# Altium project SlideRailCtrl.PrjPcb
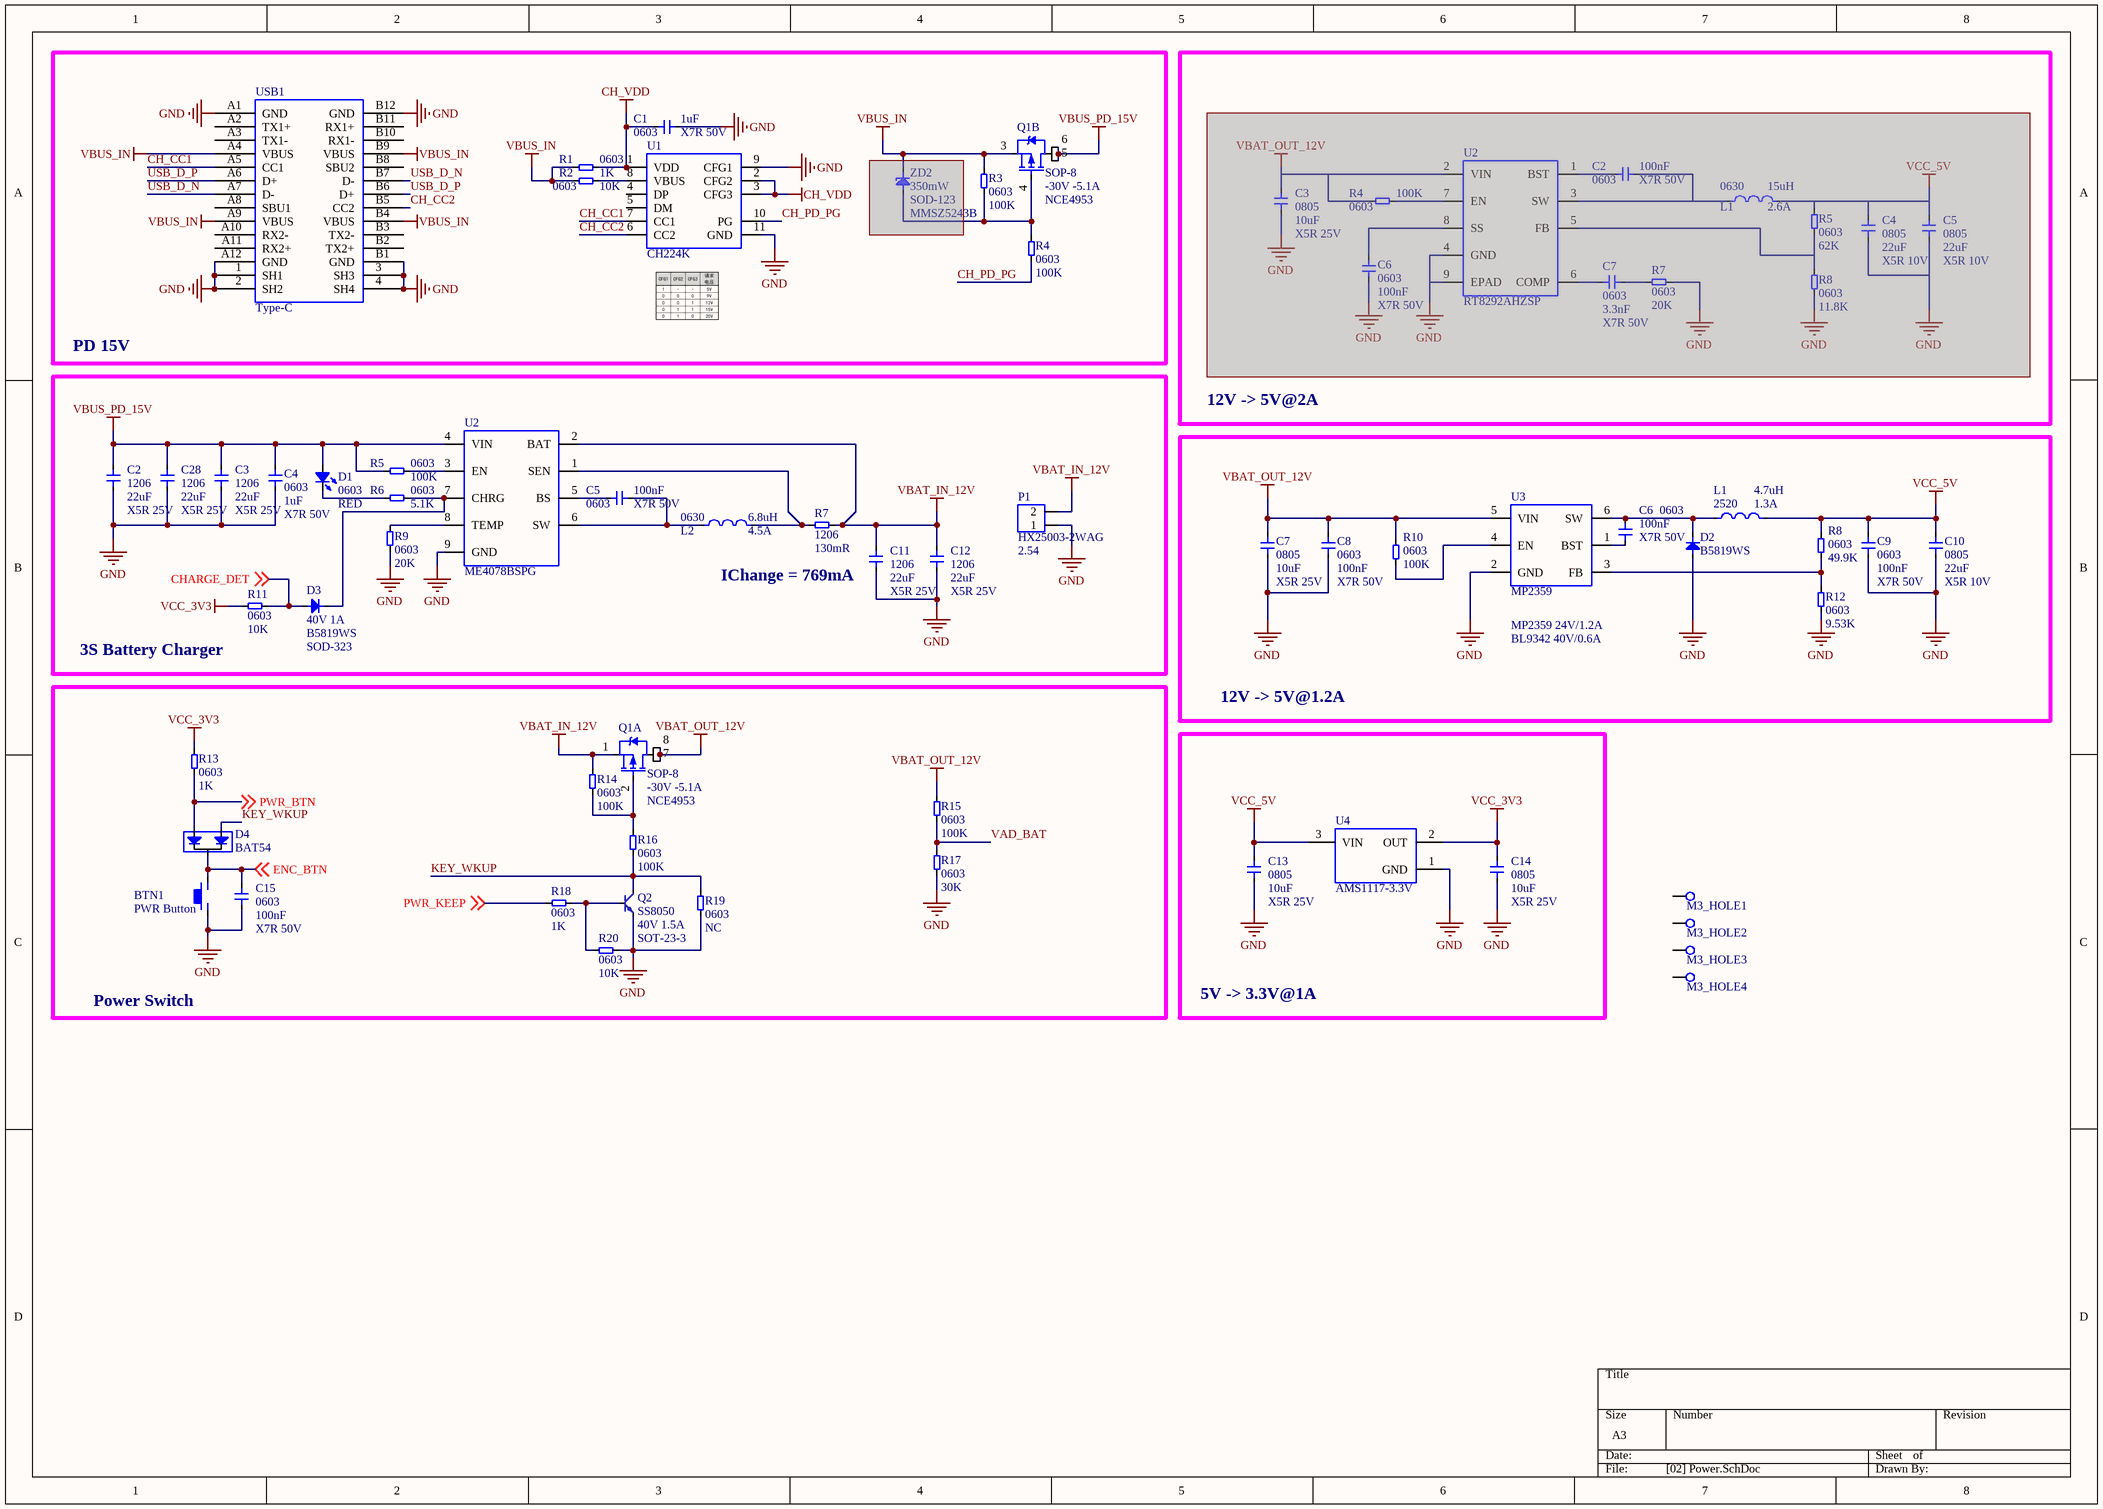
[diagram p0: [02] Power.SchDoc]
2 sheets, 115 parts. Net scope: global (net labels, ports and power ports of the same name join across sheets).
Board file: SlideRailCtrl.PcbDoc
Sheets:
  [02] Power.SchDoc
  [03] MainBoard.SchDoc

## Sheet [02] Power.SchDoc
size A3

### Parts
(Parts that share a designator on the sheet are numbered #1, #2 ... from top to bottom, then left to right.)
BTN1  PWR Button  [BTN-4P-4.2*3.4*2.5]
C1  Footprint: 0603  Specification: X7R 50V  [CAP_0603]  (hidden comment: 1uF)
C2#1  Footprint: 0603  Specification: X7R 50V  [CAP_0603]  (hidden comment: 100nF)  (masked out: inside a compile mask, not in the netlist)
C2#2  Footprint: 1206  Specification: X5R 25V  [CAP_1206]  (hidden comment: 22uF)
C3#1  Footprint: 0805  Specification: X5R 25V  [CAP_0805]  (hidden comment: 10uF)  (masked out: inside a compile mask, not in the netlist)
C3#2  Footprint: 1206  Specification: X5R 25V  [CAP_1206]  (hidden comment: 22uF)
C4#1  Footprint: 0805  Specification: X5R 10V  [CAP_0805]  (hidden comment: 22uF)  (masked out: inside a compile mask, not in the netlist)
C4#2  Footprint: 0603  Specification: X7R 50V  [CAP_0603]  (hidden comment: 1uF)
C5#1  Footprint: 0805  Specification: X5R 10V  [CAP_0805]  (hidden comment: 22uF)  (masked out: inside a compile mask, not in the netlist)
C5#2  Footprint: 0603  Specification: X7R 50V  [CAP_0603]  (hidden comment: 100nF)
C6#1  Footprint: 0603  Specification: X7R 50V  [CAP_0603]  (hidden comment: 100nF)  (masked out: inside a compile mask, not in the netlist)
C6#2  Footprint: 0603  Specification: X7R 50V  [CAP_0603]  (hidden comment: 100nF)
C7#1  Footprint: 0603  Specification: X7R 50V  [CAP_0603]  (hidden comment: 3.3nF)  (masked out: inside a compile mask, not in the netlist)
C7#2  Footprint: 0805  Specification: X5R 25V  [CAP_0805]  (hidden comment: 10uF)
C8  Footprint: 0603  Specification: X7R 50V  [CAP_0603]  (hidden comment: 100nF)
C9  Footprint: 0603  Specification: X7R 50V  [CAP_0603]  (hidden comment: 100nF)
C10  Footprint: 0805  Specification: X5R 10V  [CAP_0805]  (hidden comment: 22uF)
C11  Footprint: 1206  Specification: X5R 25V  [CAP_1206]  (hidden comment: 22uF)
C12  Footprint: 1206  Specification: X5R 25V  [CAP_1206]  (hidden comment: 22uF)
C13  Footprint: 0805  Specification: X5R 25V  [CAP_0805]  (hidden comment: 10uF)
C14  Footprint: 0805  Specification: X5R 25V  [CAP_0805]  (hidden comment: 10uF)
C15  Footprint: 0603  Specification: X7R 50V  [CAP_0603]  (hidden comment: 100nF)
C28  Footprint: 1206  Specification: X5R 25V  [CAP_1206]  (hidden comment: 22uF)
D1  Footprint: 0603  [LED_0603]  (hidden comment: RED)
D2  B5819WS  [SOD-323]
D3  Specification: 40V 1A  [SOD-323]  (hidden comment: B5819WS)
D4#1  BAT54  [SOT-23-3]
L1#1  Specification: 2.6A  Footprint: 0630  [IND_P_0630]  (hidden comment: 15uH)  (masked out: inside a compile mask, not in the netlist)
L1#2  Specification: 1.3A  Footprint: 2520  [IND_1008]  (hidden comment: 4.7uH)
L2  Specification: 4.5A  Footprint: 0630  [IND_P_0630]  (hidden comment: 6.8uH)
M3_HOLE1  TestPoint  [Hole_M3_PAD]  (value not drawn)
M3_HOLE2  TestPoint  [Hole_M3_PAD]  (value not drawn)
M3_HOLE3  TestPoint  [Hole_M3_PAD]  (value not drawn)
M3_HOLE4  TestPoint  [Hole_M3_PAD]  (value not drawn)
P1  Type: 2.54  [XH_2-SLEEP]  (hidden comment: HX25003-2WAG)
Q1  Footprint: SOP-8  Specification: -30V -5.1A  [SOP-8-P1.27]  (hidden comment: NCE4953)  (parts A,B of 2)
Q2  Specification: 40V 1.5A  [SOT-23-3]  (hidden comment: SS8050)
R1  Footprint: 0603  [RES_0603]  (hidden comment: 1K)
R2  Footprint: 0603  [RES_0603]  (hidden comment: 10K)
R3  Footprint: 0603  [RES_0603]  (hidden comment: 100K)
R4#1  Footprint: 0603  [RES_0603]  (hidden comment: 100K)  (masked out: inside a compile mask, not in the netlist)
R4#2  Footprint: 0603  [RES_0603]  (hidden comment: 100K)
R5#1  Footprint: 0603  [RES_0603]  (hidden comment: 62K)  (masked out: inside a compile mask, not in the netlist)
R5#2  Footprint: 0603  [RES_0603]  (hidden comment: 100K)
R6  Footprint: 0603  [RES_0603]  (hidden comment: 5.1K)
R7#1  Footprint: 0603  [RES_0603]  (hidden comment: 20K)  (masked out: inside a compile mask, not in the netlist)
R7#2  Footprint: 1206  [RES_1206]  (hidden comment: 130mR)
R8#1  Footprint: 0603  [RES_0603]  (hidden comment: 11.8K)  (masked out: inside a compile mask, not in the netlist)
R8#2  Footprint: 0603  [RES_0603]  (hidden comment: 49.9K)
R9  Footprint: 0603  [RES_0603]  (hidden comment: 20K)
R10  Footprint: 0603  [RES_0603]  (hidden comment: 100K)
R11#1  Footprint: 0603  [RES_0603]  (hidden comment: 10K)
R12#1  Footprint: 0603  [RES_0603]  (hidden comment: 9.53K)
R13  Footprint: 0603  [RES_0603]  (hidden comment: 1K)
R14  Footprint: 0603  [RES_0603]  (hidden comment: 100K)
R15  Footprint: 0603  [RES_0603]  (hidden comment: 100K)
R16#1  Footprint: 0603  [RES_0603]  (hidden comment: 100K)
R17  Footprint: 0603  [RES_0603]  (hidden comment: 30K)
R18  Footprint: 0603  [RES_0603]  (hidden comment: 1K)
R19  Footprint: 0603  [RES_0603]  (hidden comment: NC)
R20  Footprint: 0603  [RES_0603]  (hidden comment: 10K)
U1  CH224K  [HSOP-10-P1.0]
U2#1  RT8292AHZSP  [HSOP-8-P1.27]  (masked out: inside a compile mask, not in the netlist)
U2#2  ME4078BSPG  [HSOP-8-P1.27]
U3  MP2359  [SOT-23-6]
U4  AMS1117-3.3V  [SOT-223-3]
USB1  Type-C  [USB-Type-C]
ZD2  Specification: 350mW  [SOD-123]  (hidden comment: MMSZ5243B)  (masked out: inside a compile mask, not in the netlist)

### Blocks framed on the sheet
PD 15V: C1 Q1 R1-R3 R4#2 U1 USB1 ZD2
12V -> 5V@2A: C2#1 C3#1 C4#1 C5#1 C6#1 C7#1 L1#1 R4#1 R5#1 R7#1 R8#1 U2#1
12V -> 5V@1.2A: C6#2 C7#2 C8-C10 D2 L1#2 R8#2 R10 R12#1 U3
Power Switch: BTN1 C15 D4#1 Q1 Q2 R13-R15 R16#1 R17-R20
5V -> 3.3V@1A: C13 C14 U4

### Nets
CH_VDD: C1.1 R1.1 U1.1(VDD) U1.2(CFG2) U1.3(CFG3)
GND: BTN1.1 C1.2 C2#2.1 C3#2.1 C4#2.2 C7#2.2 C8.2 C9.2 C10.2 C11.1 C12.1 C13.1 C14.1 C15.2 C28.1 D2.1 P1.1 Q2.2(E) R9.2 R12#1.2 R17.1 R19.2 R20.1 U1.9(CFG1) U1.11(GND) U2#2.9(GND) U3.2(GND) U4.1(GND) USB1.1(SH1) USB1.2(SH2) USB1.3(SH3) USB1.4(SH4) USB1.A1(GND) USB1.A12(GND) USB1.B1(GND) USB1.B12(GND)
VBAT_IN_12V: C11.2 C12.2 P1.2 Q1.1(S) R7#2.1 R14.2 U2#2.2(BAT)
VBAT_OUT_12V: C7#2.1 C8.1 Q1.7(D) Q1.8(D) R10.1 R15.2 U3.5(VIN)
VBUS_IN: Q1.3(S) R1.2 R2.2 R3.2 USB1.A4(VBUS) USB1.A9(VBUS) USB1.B4(VBUS) USB1.B9(VBUS)
VBUS_PD_15V: C2#2.2 C3#2.2 C4#2.1 C28.2 D1.1(A) Q1.5(D) Q1.6(D) R5#2.2 U2#2.4(VIN)
VCC_3V3: C14.2 R11#1.1 R13.2 U4.2(OUT)
VCC_5V: C9.1 C10.1 C13.2 L1#2.2 R8#2.1 U4.3(VIN)
CH_CC1: U1.7(CC1) USB1.A5(CC1)
CH_CC2: U1.6(CC2) USB1.B5(CC2)
CH_PD_PG: R4#2.1 U1.10(PG)
CHARGE_DET: D3.1 R11#1.2 ; off-sheet CHARGE_DET
ENC_BTN: BTN1.2 C15.1 D4#1.3 ; off-sheet ENC_BTN
KEY_WKUP: D4#1.2 Q2.3(C) R16#1.1 R19.1
PWR_BTN: D4#1.1 R13.1 ; off-sheet PWR_BTN
PWR_KEEP: R18.1 ; off-sheet PWR_KEEP
USB_D_N: USB1.A7(D-) USB1.B7(D-)
USB_D_P: USB1.A6(D+) USB1.B6(D+)
VAD_BAT: R15.1 R17.2
NetC5#2_1: C5#2.1 L2.1 U2#2.6(SW)
NetC5#2_2: C5#2.2 U2#2.5(BS)
NetC6#2_1: C6#2.1 D2.2 L1#2.1 U3.6(SW)
NetC6#2_2: C6#2.2 U3.1(BST)
NetD1_2: D1.2(K) R6.2
NetD3_2: D3.2 R6.1 U2#2.7(CHRG)
NetL2_2: L2.2 R7#2.2 U2#2.1(SEN)
NetQ1_2: Q1.2(G) R14.1 R16#1.2
NetQ1_4: Q1.4(G) R3.1 R4#2.2
NetQ2_1: Q2.1(B) R18.2 R20.2
NetR2_1: R2.1 U1.8(VBUS)
NetR5#2_1: R5#2.1 U2#2.3(EN)
NetR8#2_2: R8#2.2 R12#1.1 U3.3(FB)
NetR9_1: R9.1 U2#2.8(TEMP)
NetR10_2: R10.2 U3.4(EN)

Not connected (* = marked no-connect by the designer): M3_HOLE1 1; M3_HOLE2 1; M3_HOLE3 1; M3_HOLE4 1; U1 4(DP) 5(DM); USB1 A2(TX1+) A3(TX1-) A8(SBU1) A10(RX2-) A11(RX2+) B2(TX2+) B3(TX2-) B8(SBU2) B10(RX1-) B11(RX1+)

### Notes on the sheet
- IChange = 769mA
- (near U3) MP2359 24V/1.2A
- BL9342 40V/0.6A
- (near R11#1) 3S Battery Charger
- Title
- Size:
- Date:
- A4
- Number:
- Time:
- Revision:
- Sheet
- of
- File:

### Library data of the parts
BTN1 = Button
C1 C2#1 C2#2 C3#1 C3#2 C4#1 C4#2 C5#1 C5#2 C6#1 C6#2 C7#1 C7#2 C8-C15 C28 = CAP: Capacitor; Manufacturer: *
  C1 C4#2: Value: 1uF
  C2#1 C5#2 C6#1 C6#2 C8 C9 C15: Value: 100nF
  C2#2 C3#2 C4#1 C5#1 C10-C12 C28: Value: 22uF
  C3#1 C7#2 C13 C14: Value: 10uF
  C7#1: Value: 3.3nF
D1 = LED: Value: RED
D2 = Diode: Specification: 40V 1A; Manufacturer: *; Value: B5819WS
D3 = Diode: Manufacturer: *; Value: B5819WS
D4#1 = Diode-2: Value: BAT54
L1#1 L1#2 L2 = IND: Inductor; Manufacturer: *
  L1#1: Value: 15uH
  L1#2: Value: 4.7uH
  L2: Value: 6.8uH
P1 = HDR1x2: Header; Value: HX25003-2WAG
Q1 = Dual_MOS-P: Dual P-Channel MOSFET; Value: NCE4953
Q2 = BJT_NPN: Transistor; Value: SS8050
R1-R3 R4#1 R4#2 R5#1 R5#2 R6 R7#1 R7#2 R8#1 R8#2 R9 R10 R11#1 R12#1 R13-R15 R16#1 R17-R20 = RES: Resistor; Specification: ±1%; Manufacturer: *
  R1 R13 R18: Value: 1K
  R2 R11#1 R20: Value: 10K
  R3 R4#1 R4#2 R5#2 R10 R14 R15 R16#1: Value: 100K
  R5#1: Value: 62K
  R6: Value: 5.1K
  R7#1 R9: Value: 20K
  R7#2: Value: 130mR
  R8#1: Value: 11.8K
  R8#2: Value: 49.9K
  R12#1: Value: 9.53K
  R17: Value: 30K
  R19: Value: NC
U1 = CH224K: USB PD 等多快充协议受电芯片
U2#1 = RT8292A: 2A, 23V, 340kHz Synchronous Step-Down Converter
U2#2 = ME4078: 双节、三节开关型锂电池管理
U3 = MP2456
U4 = LM1117-3.3V
USB1 = USB-Type-C
ZD2 = Diode-ZD: Zender Diode; Manufacturer: *; Value: MMSZ5243B

## Sheet [03] MainBoard.SchDoc
size A3
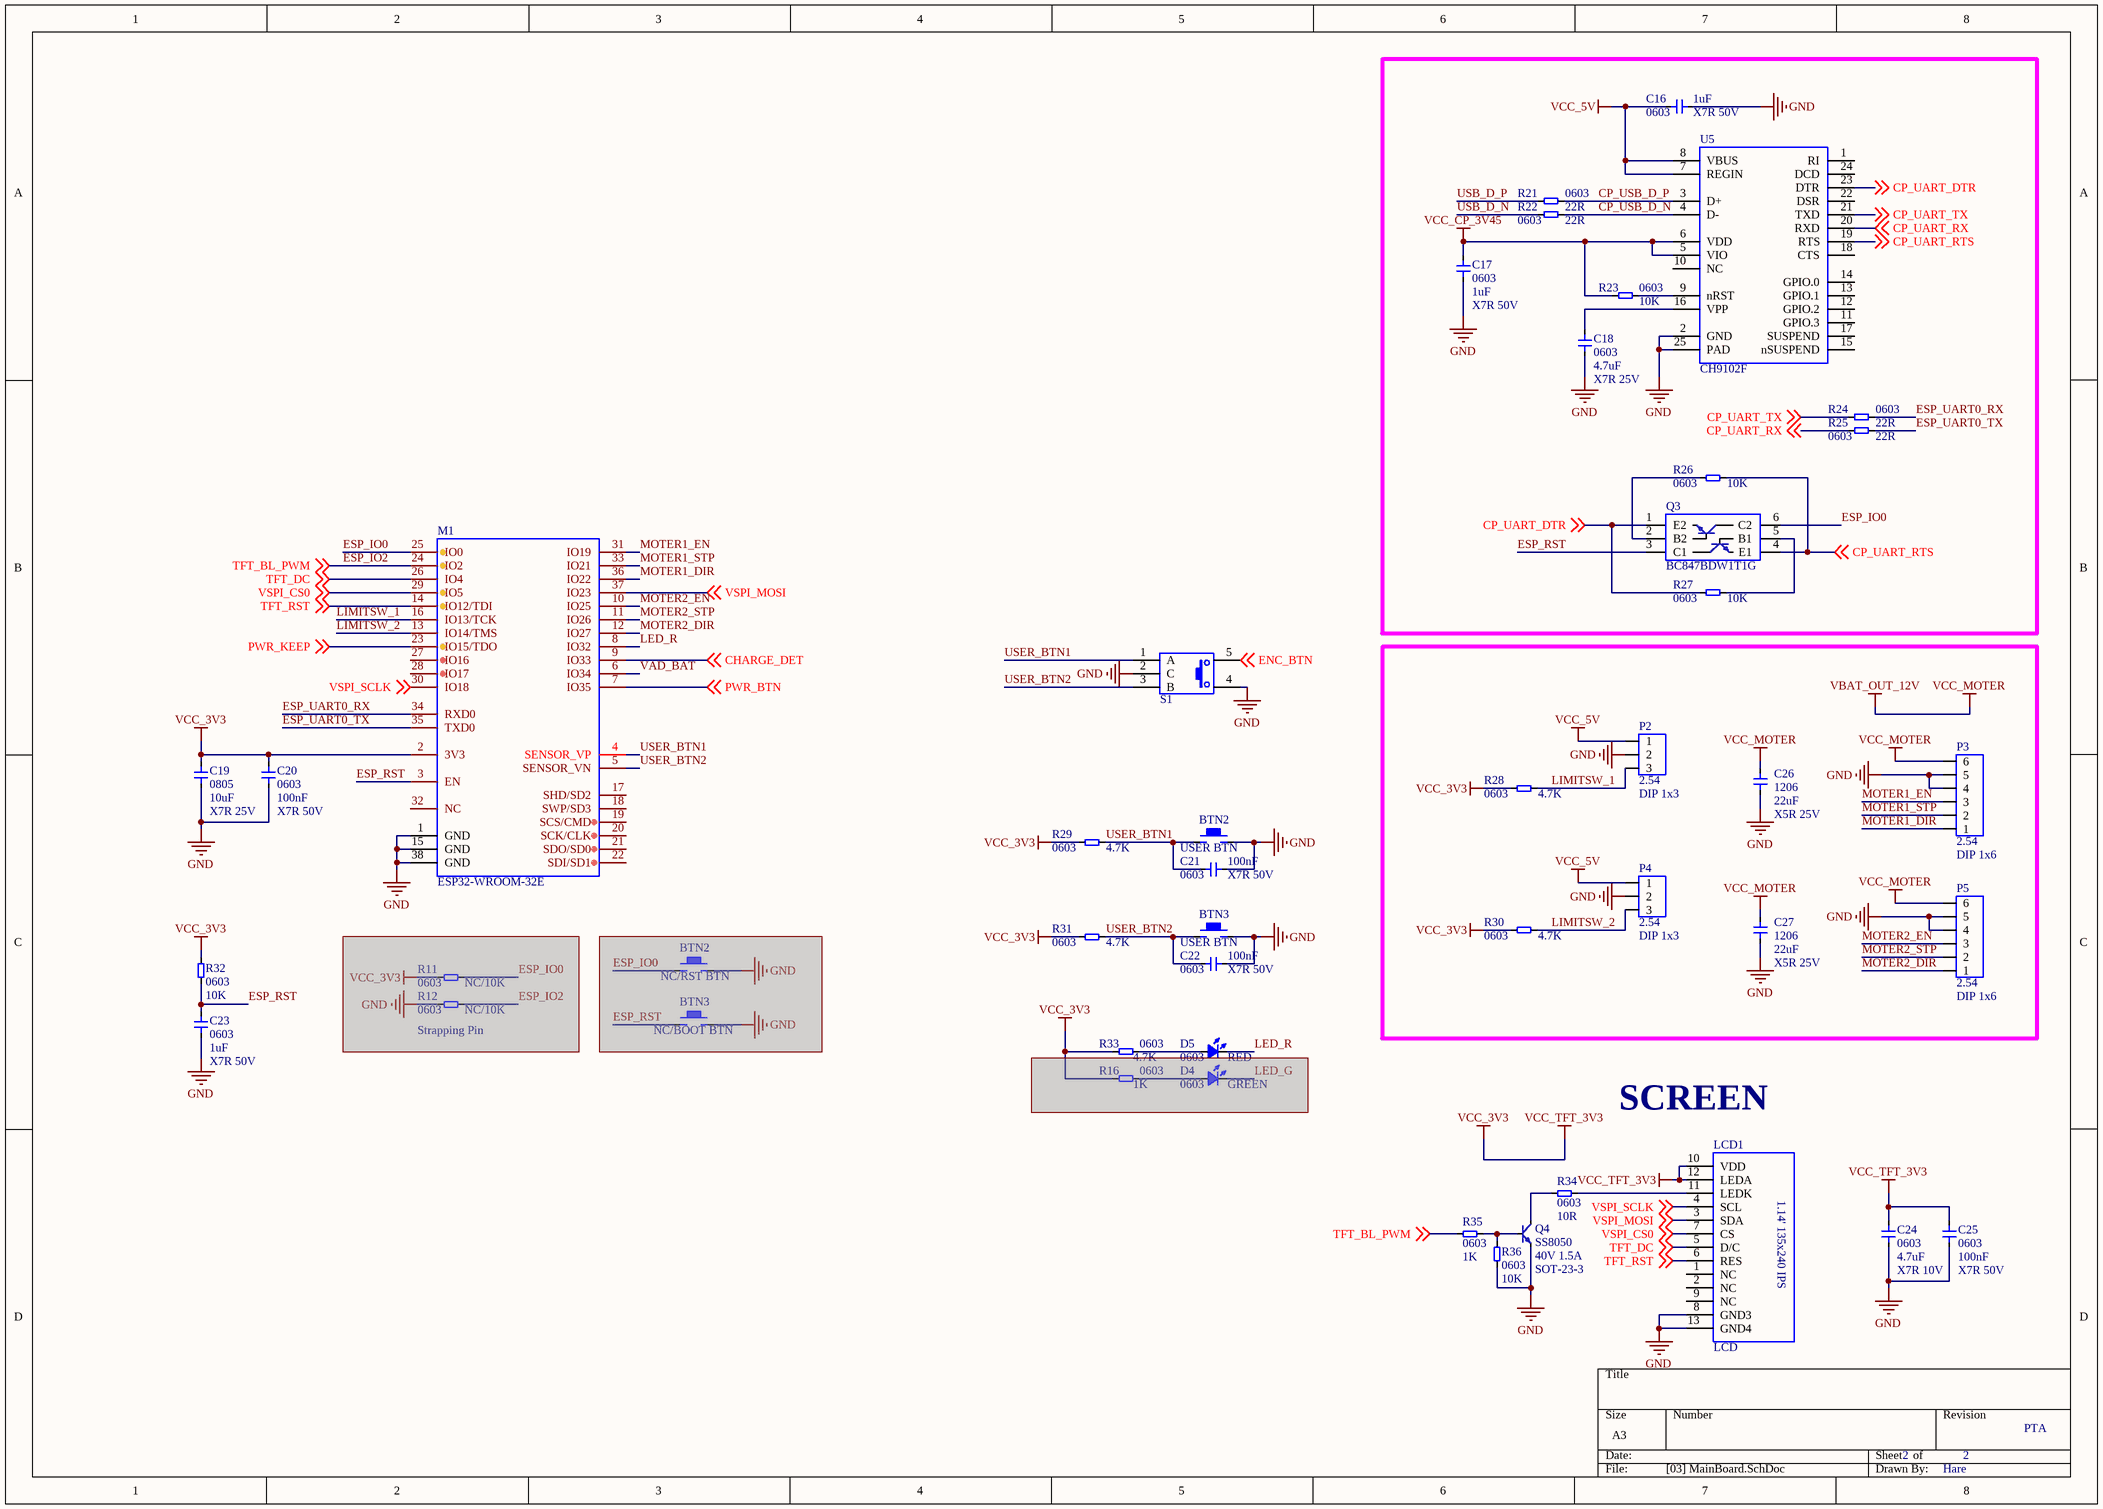
[diagram p1: [03] MainBoard.SchDoc]

### Parts
(Parts that share a designator on the sheet are numbered #1, #2 ... from top to bottom, then left to right.)
BTN2#1  USER BTN  [BTN-4P-4.2*3.4*2.5]
BTN2#2  NC/RST BTN  [BTN-4P-3.0*6.0*3.5]  (masked out: inside a compile mask, not in the netlist)
BTN3#1  USER BTN  [BTN-4P-4.2*3.4*2.5]
BTN3#2  NC/BOOT BTN  [BTN-4P-3.0*6.0*3.5]  (masked out: inside a compile mask, not in the netlist)
C16  Footprint: 0603  Specification: X7R 50V  [CAP_0603]  (hidden comment: 1uF)
C17  Footprint: 0603  Specification: X7R 50V  [CAP_0603]  (hidden comment: 1uF)
C18  Footprint: 0603  Specification: X7R 25V  [CAP_0603]  (hidden comment: 4.7uF)
C19  Footprint: 0805  Specification: X7R 25V  [CAP_0805]  (hidden comment: 10uF)
C20  Footprint: 0603  Specification: X7R 50V  [CAP_0603]  (hidden comment: 100nF)
C21  Footprint: 0603  Specification: X7R 50V  [CAP_0603]  (hidden comment: 100nF)
C22  Footprint: 0603  Specification: X7R 50V  [CAP_0603]  (hidden comment: 100nF)
C23  Footprint: 0603  Specification: X7R 50V  [CAP_0603]  (hidden comment: 1uF)
C24  Footprint: 0603  Specification: X7R 10V  [CAP_0603]  (hidden comment: 4.7uF)
C25  Footprint: 0603  Specification: X7R 50V  [CAP_0603]  (hidden comment: 100nF)
C26  Footprint: 1206  Specification: X5R 25V  [CAP_1206]  (hidden comment: 22uF)
C27  Footprint: 1206  Specification: X5R 25V  [CAP_1206]  (hidden comment: 22uF)
D4#2  Footprint: 0603  [LED_DIP_3MM]  (hidden comment: GREEN)  (masked out: inside a compile mask, not in the netlist)
D5  Footprint: 0603  [LED_0603]  (hidden comment: RED)
LCD1  LCD  [LCD-IPS-1.14-135x240-TOP]
M1  ESP32-WROOM-32E  [ESP-32]
P2  Type: 2.54  [XH_3-sleep]  (hidden comment: DIP 1x3)
P3  Type: 2.54  [XH_6-sleep]  (hidden comment: DIP 1x6)
P4  Type: 2.54  [XH_3-sleep]  (hidden comment: DIP 1x3)
P5  Type: 2.54  [XH_6-sleep]  (hidden comment: DIP 1x6)
Q3  BC847BDW1T1G  [SC70-6]
Q4  Specification: 40V 1.5A  [SOT-23-3]  (hidden comment: SS8050)
R11#2  Footprint: 0603  [RES_0603]  (hidden comment: NC/10K)  (masked out: inside a compile mask, not in the netlist)
R12#2  Footprint: 0603  [RES_0603]  (hidden comment: NC/10K)  (masked out: inside a compile mask, not in the netlist)
R16#2  Footprint: 0603  [RES_0603]  (hidden comment: 1K)  (masked out: inside a compile mask, not in the netlist)
R21  Footprint: 0603  [RES_0603]  (hidden comment: 22R)
R22  Footprint: 0603  [RES_0603]  (hidden comment: 22R)
R23  Footprint: 0603  [RES_0603]  (hidden comment: 10K)
R24  Footprint: 0603  [RES_0603]  (hidden comment: 22R)
R25  Footprint: 0603  [RES_0603]  (hidden comment: 22R)
R26  Footprint: 0603  [RES_0603]  (hidden comment: 10K)
R27  Footprint: 0603  [RES_0603]  (hidden comment: 10K)
R28  Footprint: 0603  [RES_0603]  (hidden comment: 4.7K)
R29  Footprint: 0603  [RES_0603]  (hidden comment: 4.7K)
R30  Footprint: 0603  [RES_0603]  (hidden comment: 4.7K)
R31  Footprint: 0603  [RES_0603]  (hidden comment: 4.7K)
R32  Footprint: 0603  [RES_0603]  (hidden comment: 10K)
R33  Footprint: 0603  [RES_0603]  (hidden comment: 4.7K)
R34  Footprint: 0603  [RES_0603]  (hidden comment: 10R)
R35  Footprint: 0603  [RES_0603]  (hidden comment: 1K)
R36  Footprint: 0603  [RES_0603]  (hidden comment: 10K)
S1  RotaryEncoder  [RotaryEncoder]  (value not drawn)
U5  CH9102F  [QFN-24-4.0X4.0-P0.5]

### Nets
GND: BTN2#1.2 BTN3#1.2 C16.1 C17.2 C18.2 C19.1 C20.1 C21.1 C22.1 C23.1 C24.1 C25.2 C26.1 C27.1 LCD1.8(GND3) LCD1.13(GND4) M1.1(GND) M1.15(GND) M1.38(GND) P2.2 P3.4 P3.5 P4.2 P5.4 P5.5 Q4.2(E) R36.1 S1.2(C) S1.4 U5.2(GND) U5.25(PAD)
VBAT_OUT_12V: C26.2 C27.2 P3.6 P5.6  [also labelled VCC_MOTER]
VCC_3V3: C19.2 C20.2 C24.2 C25.1 LCD1.10(VDD) LCD1.12(LEDA) M1.2(3V3) R28.1 R29.1 R30.1 R31.1 R32.2 R33.1  [also labelled VCC_TFT_3V3]
VCC_5V: C16.2 P2.1 P4.1 U5.7(REGIN) U5.8(VBUS)
VCC_CP_3V45: C17.1 R23.1 U5.5(VIO) U5.6(VDD)
CHARGE_DET: M1.9(IO33) ; off-sheet CHARGE_DET
CP_UART_DTR: Q3.1(E2) R27.1 U5.23(DTR) ; off-sheet CP_UART_DTR
CP_UART_RTS: Q3.4(E1) R26.2 U5.19(RTS) ; off-sheet CP_UART_RTS
CP_UART_RX: R25.2 U5.20(RXD) ; off-sheet CP_UART_RX
CP_UART_TX: R24.2 U5.21(TXD) ; off-sheet CP_UART_TX
CP_USB_D_N: R22.1 U5.4(D-)
CP_USB_D_P: R21.1 U5.3(D+)
ENC_BTN: S1.5 ; off-sheet ENC_BTN
ESP_IO0: M1.25(IO0) Q3.6(C2)
ESP_IO2: M1.24(IO2) R35.2 ; off-sheet TFT_BL_PWM  [also labelled TFT_BL_PWM]
ESP_RST: C23.2 M1.3(EN) Q3.3(C1) R32.1
ESP_UART0_RX: M1.34(RXD0) R24.1
ESP_UART0_TX: M1.35(TXD0) R25.1
LED_R: D5.2(K) M1.8(IO32)
LIMITSW_1: M1.16(IO13/TCK) P2.3 R28.2
LIMITSW_2: M1.13(IO14/TMS) P4.3 R30.2
MOTER1_DIR: M1.36(IO22) P3.1
MOTER1_EN: M1.31(IO19) P3.3
MOTER1_STP: M1.33(IO21) P3.2
MOTER2_DIR: M1.12(IO27) P5.1
MOTER2_EN: M1.10(IO25) P5.3
MOTER2_STP: M1.11(IO26) P5.2
PWR_BTN: M1.7(IO35) ; off-sheet PWR_BTN
PWR_KEEP: M1.23(IO15/TDO) ; off-sheet PWR_KEEP
TFT_DC: LCD1.5(D/C) M1.26(IO4) ; off-sheet TFT_DC
TFT_RST: LCD1.6(RES) M1.14(IO12/TDI) ; off-sheet TFT_RST
USB_D_N: R22.2
USB_D_P: R21.2
USER_BTN1: BTN2#1.1 C21.2 M1.4(SENSOR_VP) R29.2 S1.1(A)
USER_BTN2: BTN3#1.1 C22.2 M1.5(SENSOR_VN) R31.2 S1.3(B)
VAD_BAT: M1.6(IO34)
VSPI_CS0: LCD1.7(CS) M1.29(IO5) ; off-sheet VSPI_CS0
VSPI_MOSI: LCD1.3(SDA) M1.37(IO23) ; off-sheet VSPI_MOSI
VSPI_SCLK: LCD1.4(SCL) M1.30(IO18) ; off-sheet VSPI_SCLK
NetC18_1: C18.1 U5.16(VPP)
NetD5_1: D5.1(A) R33.2
NetLCD1_11: LCD1.11(LEDK) R34.2
NetQ3_2: Q3.2(B2) R26.1
NetQ3_5: Q3.5(B1) R27.2
NetQ4_1: Q4.1(B) R35.1 R36.2
NetQ4_3: Q4.3(C) R34.1
NetR23_2: R23.2 U5.9(nRST)

Not connected (* = marked no-connect by the designer): LCD1 1(NC) 2(NC) 9(NC); M1 17(SHD/SD2) 18(SWP/SD3) 19(SCS/CMD) 20(SCK/CLK) 21(SDO/SD0) 22(SDI/SD1) 27(IO16) 28(IO17) 32(NC); U5 1(RI) 10(NC) 11(GPIO.3) 12(GPIO.2) 13(GPIO.1) 14(GPIO.0) 15(nSUSPEND) 17(SUSPEND) 18(CTS) 22(DSR) 24(DCD)

### Notes on the sheet
- (near R12#2) Strapping Pin
- (near LCD1) SCREEN
- 2
- PTA
- Hare
- Title
- Size:
- Date:
- A4
- Number:
- Time:
- Revision:
- Sheet
- of
- File:
- (in symbol LCD_IPS_1.14_135x240) 1.14' 135x240 IPS

### Library data of the parts
BTN2#1 BTN2#2 BTN3#1 BTN3#2 = Button
C16-C27 = CAP: Capacitor; Manufacturer: *
  C16 C17 C23: Value: 1uF
  C18 C24: Value: 4.7uF
  C19: Value: 10uF
  C20-C22 C25: Value: 100nF
  C26 C27: Value: 22uF
D4#2 D5 = LED
  D4#2: Value: GREEN
  D5: Value: RED
LCD1 = LCD_IPS_1.14_135x240
M1 = ESP32-WROOM-32
P2 P4 = HDR1x3: Header; Value: DIP 1x3
P3 P5 = HDR1x6: Header; Value: DIP 1x6
Q3 = Dual_NPN: Dual NPN Transistor
Q4 = BJT_NPN: Transistor; Value: SS8050
R11#2 R12#2 R16#2 R21-R36 = RES: Resistor; Specification: ±1%; Manufacturer: *
  R11#2 R12#2: Value: NC/10K
  R16#2 R35: Value: 1K
  R21 R22 R24 R25: Value: 22R
  R23 R26 R27 R32 R36: Value: 10K
  R28-R31 R33: Value: 4.7K
  R34: Value: 10R
S1 = RotaryEncoder: Encoder; Value: RotaryEncoder
U5 = CP2104: SINGLE-CHIP USB-TO-UART BRIDGE

## Nets that join several sheets
GND: [02] Power (36 pins), [03] MainBoard (31 pins)
VBAT_OUT_12V: [02] Power (7 pins), [03] MainBoard (C26.2 C27.2 P3.6 P5.6)
VCC_3V3: [02] Power (C14.2 R11#1.1 R13.2 U4.2), [03] MainBoard (13 pins)
VCC_5V: [02] Power (6 pins), [03] MainBoard (5 pins)
CHARGE_DET: [02] Power (D3.1 R11#1.2), [03] MainBoard (M1.9)
ENC_BTN: [02] Power (BTN1.2 C15.1 D4#1.3), [03] MainBoard (S1.5)
PWR_BTN: [02] Power (D4#1.1 R13.1), [03] MainBoard (M1.7)
PWR_KEEP: [02] Power (R18.1), [03] MainBoard (M1.23)
USB_D_N: [02] Power (USB1.A7 USB1.B7), [03] MainBoard (R22.2)
USB_D_P: [02] Power (USB1.A6 USB1.B6), [03] MainBoard (R21.2)
VAD_BAT: [02] Power (R15.1 R17.2), [03] MainBoard (M1.6)